# Altium schematic sheet Power.SchDoc
size A; SheetNumber: 1; SheetTotal: 3
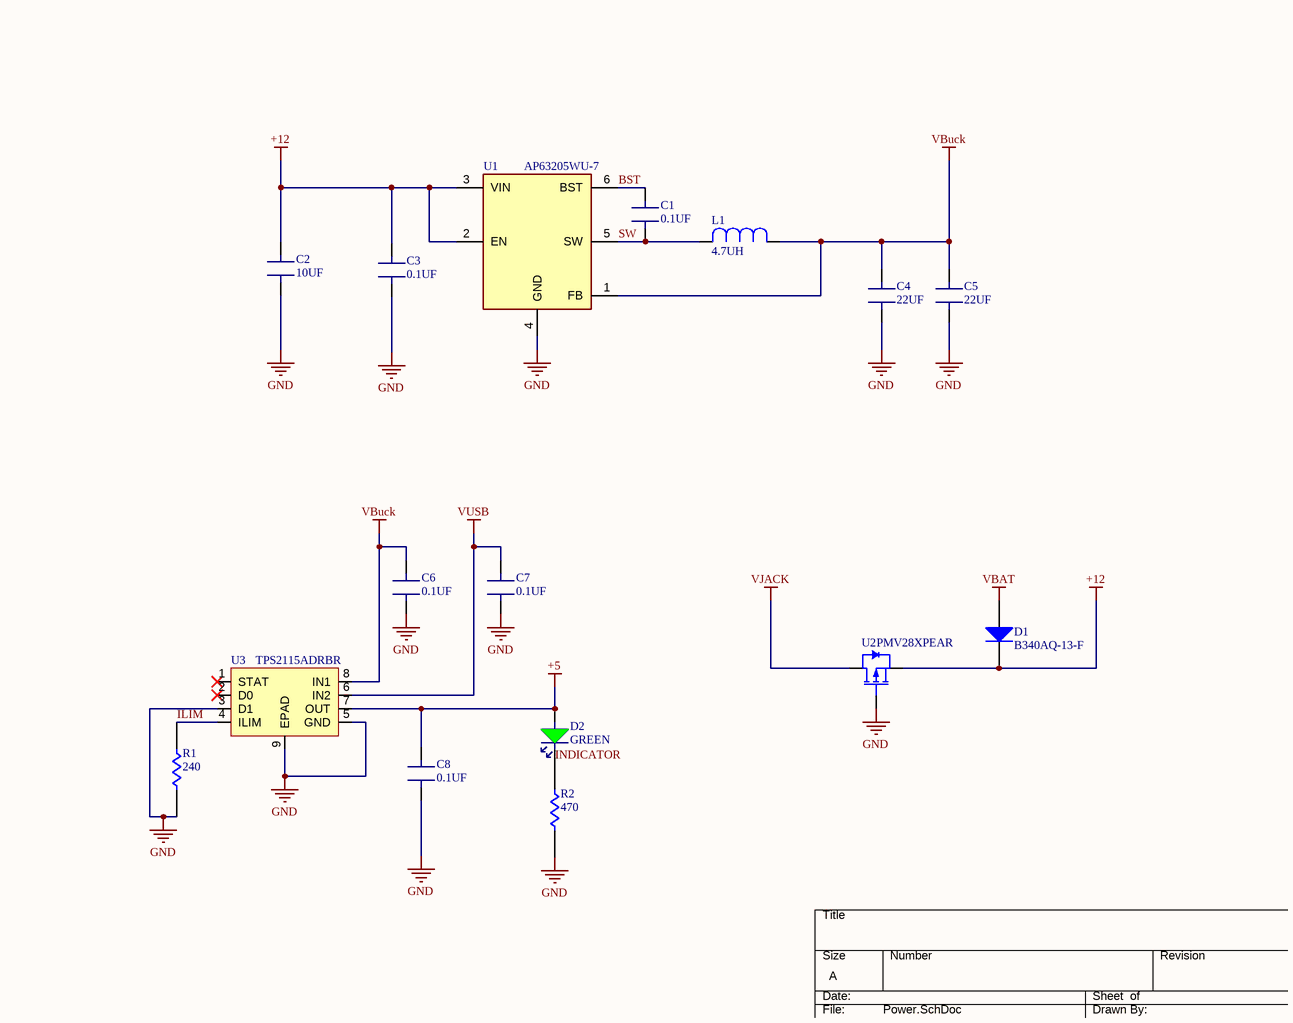
[diagram p0: Power.SchDoc]

## Parts
C1  0.1UF  [CAP: 0603]
C2  10UF  [CAP: 0805]
C3  0.1UF  [CAPC1608X90N]
C4  22UF  [CAP: 0805]
C5  22UF  [CAP: 0805]
C6  0.1UF  [CAPC1608X90N]
C7  0.1UF  [CAPC1608X90N]
C8  0.1UF  [CAPC1608X90N]
D1  B340AQ-13-F  [DO-214AC]
D2  GREEN  [LED: 0805G]
L1  4.7UH  [IND: VLS5045EX-4R7M-H]
R1  240  [RESC1608X55N]
R2  470  [RESC1608X55N]
U1  AP63205WU-7  [TSOT23-6]
U2  PMV28XPEAR  [SOT23_3]
U3  TPS2115ADRBR  [8-SON (3x3)]

## Nets
+5: C8.2(B) D2.2(A) U3.7(OUT)
+12: C2.2(B) C3.2(B) D1.2(C) U1.2(EN) U1.3(VIN) U2.2(S)
GND: C2.1(A) C3.1(A) C4.1(A) C5.1(A) C6.1(A) C7.1(A) C8.1(A) R1.1 R2.1 U1.4(GND) U2.1(G) U3.3(D1) U3.5(GND) U3.9(EPAD)
VBAT: D1.1(A)
VBuck: C4.2(B) C5.2(B) C6.2(B) L1.2 U1.1(FB) U3.8(IN1)
VJACK: U2.3(D)
VUSB: C7.2(B) U3.6(IN2)
BST: C1.2(B) U1.6(BST)
ILIM: R1.2 U3.4(ILIM)
INDICATOR: D2.1(C) R2.2
SW: C1.1(A) L1.1 U1.5(SW)

Not connected (* = marked no-connect by the designer): U3 1(STAT)* 2(D0)*

## Notes on the sheet
- DWG. NO.
- REV.
- SHT.
- THIS DOCUMENT AND THE DATA DISCLOSED HEREIN OR HEREWITH IS THE PROPERTY OF ALTIUM LIMITED AND MAY BE FREELY DISTRIBUTED IN WHOLE. NO RIGHTS ARE RESERVED OR EXPRESS OR IMPLIED WARANTEE GIVEN.
- REVISION
- DESCRIPTION
- DATE
- APPROVED
- ENG:
- APPROVALS
- PROJECT
- DSN:
- CHK:
- REFERENCE DOCUMENTS
- PROJECT REVISION:
- TITLE
- DOCUMENT REVISION:
- DESIGN ITEM:
- BOM:
- FAB DWG:
- PCB DWG:
- ASSY DWG:
- SCALE:
- SIZE
- B
- CAGE CODE
- FILE NAME
- DWG NO.
- SHEET
- OF
- REV

## Library data of the parts
C1 = CL10B104KB8NNNL: CAP CER 0.1UF 50V X7R 0603; Supplier 1: Mouser; Supplier Part Number 1: 187-CL10B104KB8NNNL
C2 = GRM21BR61H106KE43L: CAP CER 10UF 50V X5R 0805; Supplier 1: Mouser; Supplier Part Number 1: 81-GRM21BR61H106KE3L
C3 C6-C8 = CC0603KRX7R9BB104: CAP CER 0.1UF 50V 10% X7R 0603; Supplier 1: Digi-Key; Supplier Part Number 1: 311-1344-1-ND
C4 C5 = CL21A226MAYNNNE: CAP CER 22UF 25V X5R 0805; Supplier 1: Mouser; Supplier Part Number 1: 187-CL21A226MAYNNNE
D1 = B340AQ-13-F: DIODE SCHOTTKY 40V 3A SMA TR 5K; Supplier 1: Mouser; Supplier Part Number 1: 621-B340AQ-13-F
D2 = 732-4983-6-ND: LED GREEN CLEAR 0805 SMD; Supplier 1: Digi-Key; Supplier Part Number 1: 732-4983-1-ND
L1 = VLS5045EX-4R7M-H: FIXED IND 4.7UH 3.2A 46.8MOHM SM; Supplier 1: Mouser; Supplier Part Number 1: 810-VLS5045EX-4R7M-H
R1 = RMCF0603JT240RDKR-ND: RES 240 OHM 5% 1/10W 0603; Supplier 1: Digi-Key; Supplier Part Number 1: RMCF0603JT240RCT-ND
R2 = 541-4055-6-ND: RES 470 OHM 5% 1/10W 0603; Supplier 1: Digi-Key; Supplier Part Number 1: 541-4055-1-ND
U1 = AP63205WU-7: IC REG BUCK 5V 2A TSOT26; Supplier 1: Mouser; Supplier Part Number 1: 621-AP63205WU-7
U2 = PMV28XPEAR: P-Channel 20 V 5A (Ta) 610mW (Ta), 8.3W (Tc) Surface Mount TO-236AB; Supplier 1: Mouser; Supplier Part Number 1: 771-PMV28XPEAR
U3 = TPS2115ADRBR: OR Controller Source Selector Switch N-Channel 2:1 8-SON (3x3); Supplier 1: Mouser; Supplier Part Number 1: 595-TPS2115ADRBR